# Altium schematic sheet Pedal_XLR.SchDoc
size A3; SheetNumber: 1; SheetTotal: 3
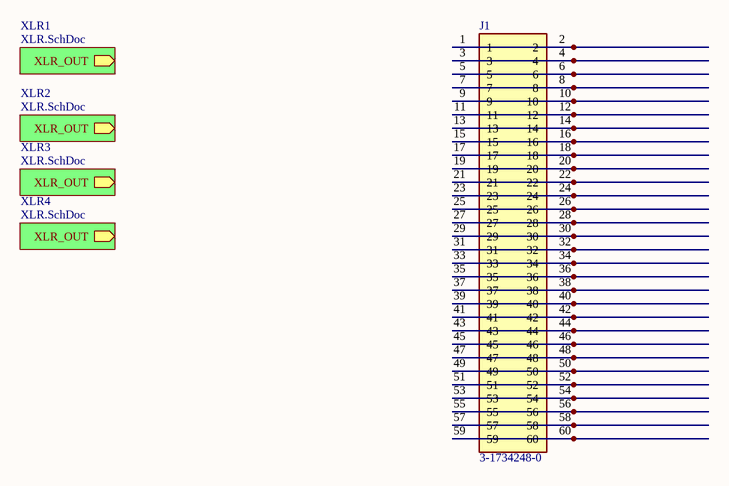
[diagram p0: Pedal_XLR.SchDoc]

## Parts
J1  3-1734248-0  [317342480]

## Sub-sheets
XLR1 = XLR.SchDoc: XLR_OUT (out)
XLR2 = XLR.SchDoc: XLR_OUT (out)
XLR3 = XLR.SchDoc: XLR_OUT (out)
XLR4 = XLR.SchDoc: XLR_OUT (out)

## Nets
NetJ1_1: J1.1 J1.2
NetJ1_3: J1.3 J1.4
NetJ1_5: J1.5 J1.6
NetJ1_7: J1.7 J1.8
NetJ1_9: J1.9 J1.10
NetJ1_11: J1.11 J1.12
NetJ1_13: J1.13 J1.14
NetJ1_15: J1.15 J1.16
NetJ1_17: J1.17 J1.18
NetJ1_19: J1.19 J1.20
NetJ1_21: J1.21 J1.22
NetJ1_23: J1.23 J1.24
NetJ1_25: J1.25 J1.26
NetJ1_27: J1.27 J1.28
NetJ1_29: J1.29 J1.30
NetJ1_31: J1.31 J1.32
NetJ1_33: J1.33 J1.34
NetJ1_35: J1.35 J1.36
NetJ1_37: J1.37 J1.38
NetJ1_39: J1.39 J1.40
NetJ1_41: J1.41 J1.42
NetJ1_43: J1.43 J1.44
NetJ1_45: J1.45 J1.46
NetJ1_47: J1.47 J1.48
NetJ1_49: J1.49 J1.50
NetJ1_51: J1.51 J1.52
NetJ1_53: J1.53 J1.54
NetJ1_55: J1.55 J1.56
NetJ1_57: J1.57 J1.58
NetJ1_59: J1.59 J1.60

## Library data of the parts
J1 = 3-1734248-0: Connector; Manufacturer_Name: TE Connectivity; Datasheet Link: https://www.te.com/commerce/DocumentDelivery/DDEController?Action=srchrtrv&DocNm=5-1773461-0_Standard_FPC_Connectors_QRG&DocType=Data%20Sheet&DocLang=English&PartCntxt=3-1734248-0&DocFormat=pdf; Height: 7.7mm; Manufacturer_Part_Number: 3-1734248-0; Mouser Part Number: 571-3-1734248-0; Mouser Price/Stock: https://www.mouser.co.uk/ProductDetail/TE-Connectivity/3-1734248-0?qs=rVE9j%252BL6g1a4TQRjUuGYiA%3D%3D; Arrow Part Number: 3-1734248-0; Arrow Price/Stock: https://www.arrow.com/en/products/3-1734248-0/te-connectivity; System: Connector